# EasyEDA Pro project ProPrj_Practice 4 layer_2025-08-23.epro, schematic 4 Analog Outputs
Board Name: 4 Analog Outputs; Create Date: 2025-08-13; Page Name: P1; Project Name: Practice 4 layer; Schematic Name: 4 Analog Outputs; Update Date: 2025-08-21; Company: EasyEDA.com; Page Size: A4; Version: V1.0
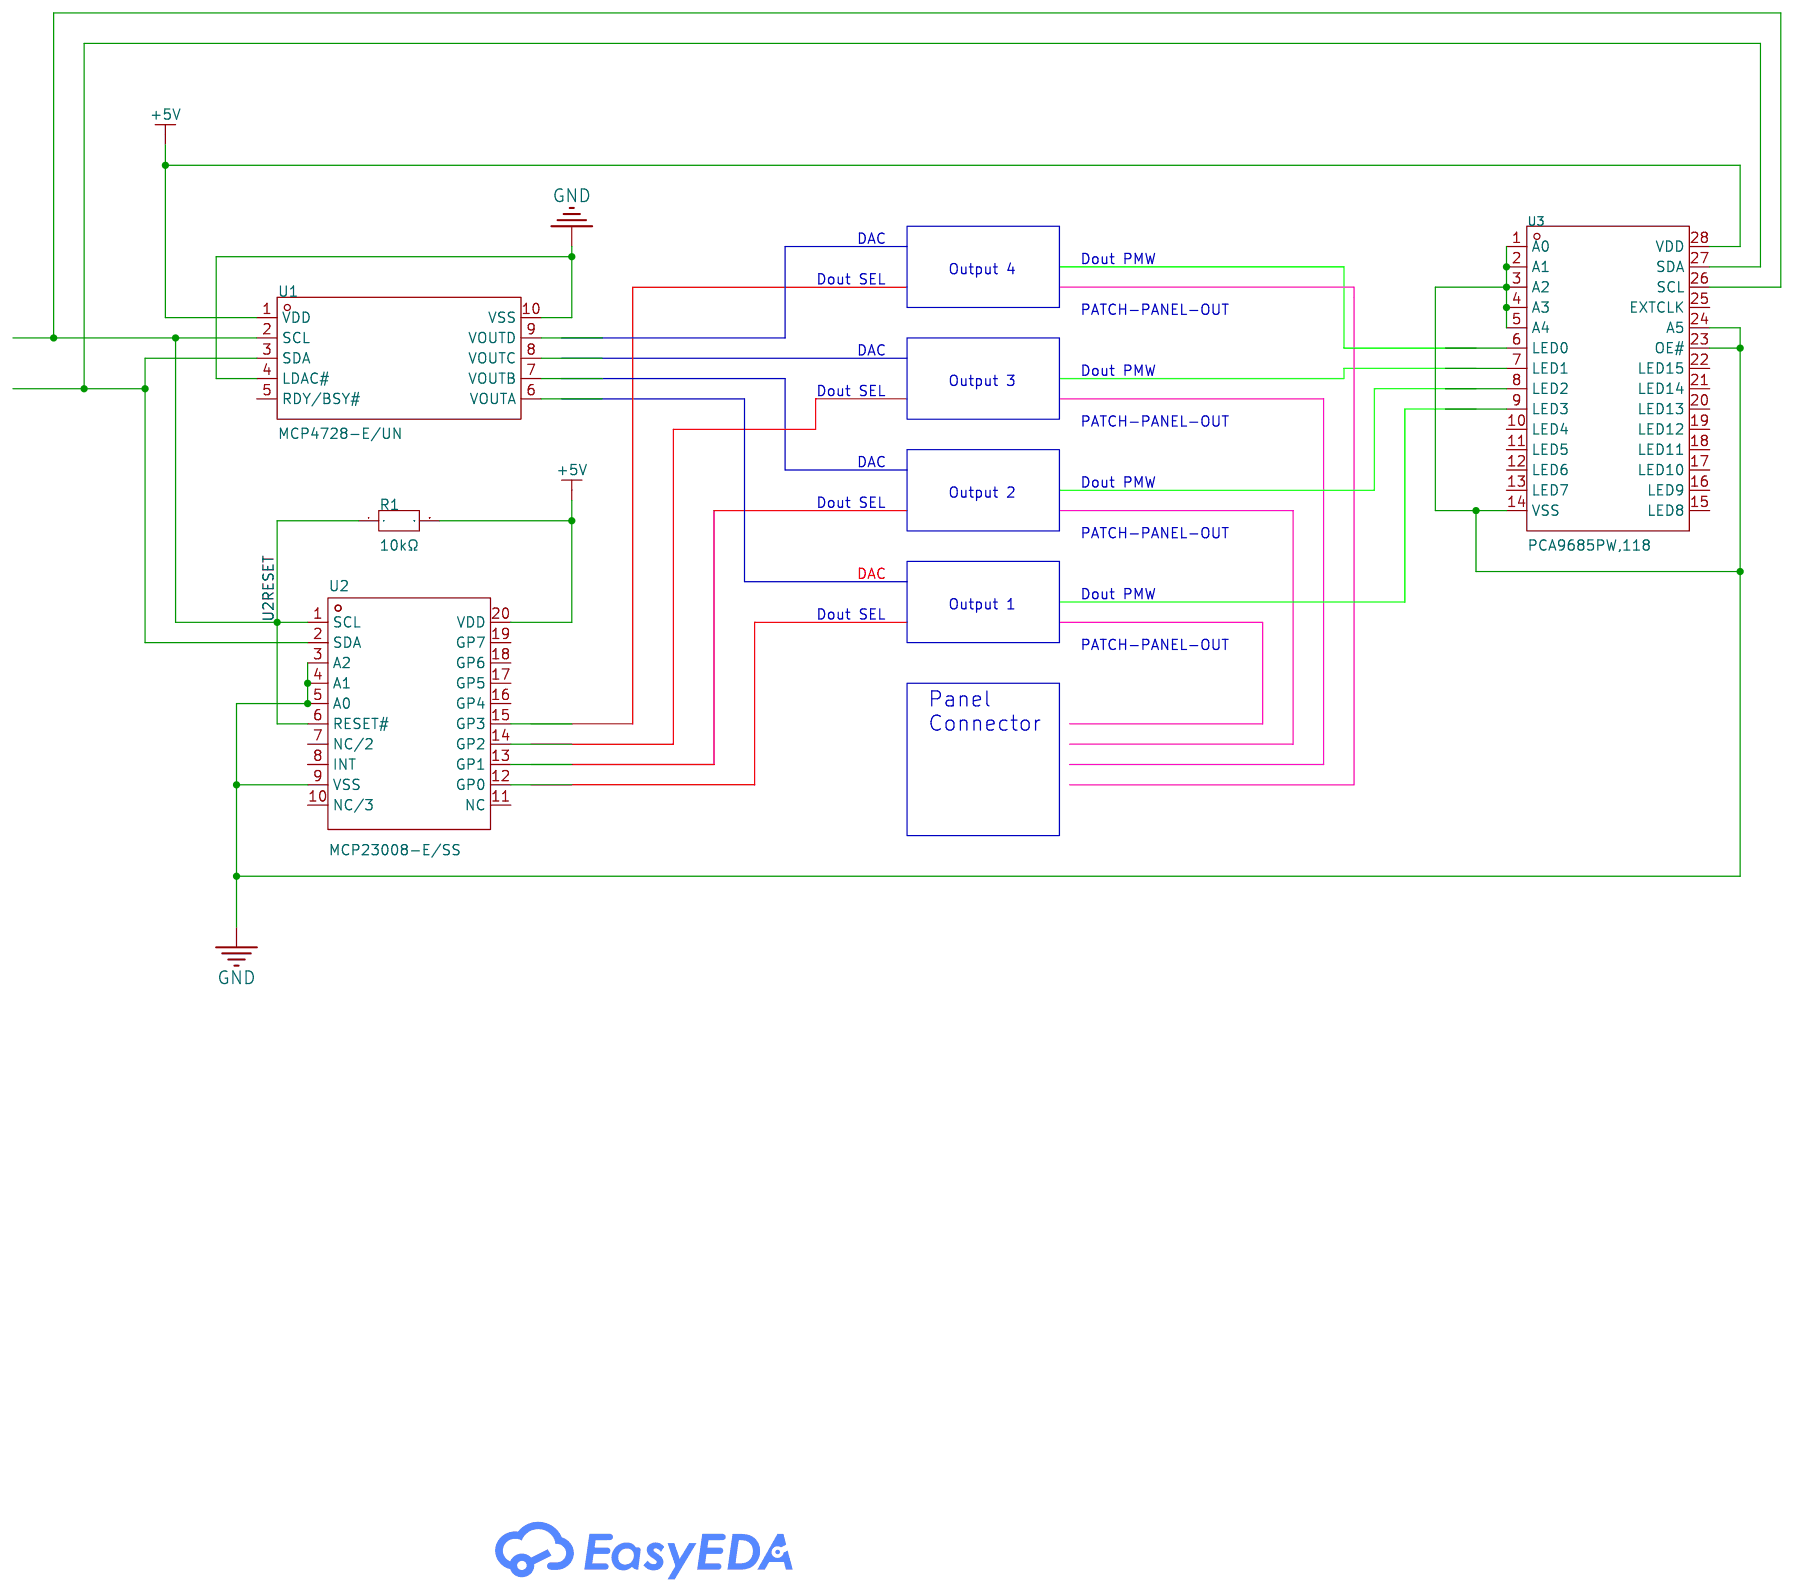
[diagram p6: schematic sheet]

## Parts
R1  10kΩ  [R0603]
U1  MCP4728-E/UN  [MSOP-10_L3.0-W3.0-P0.50-LS5.0-TL]
U2  MCP23008-E/SS  [SSOP-20_L7.2-W5.3-P0.65-LS7.8-BL]
U3  PCA9685PW,118  [TSSOP-28_L9.7-W4.4-P0.65-LS6.4-TL]

## Library data of the parts
R1 = FRC0603J103 TS: Type:Thick Film Resistors Resistance:10kΩ Tolerance:±5% Tolerance:±5% Power(Watts):0.1W Voltage-Supply(Max):75V Temperature Coefficient:±100ppm/℃ Temperature Coefficient:±100ppm/℃ Operating Temperature:-55℃~+155℃ Operating Temperature:-55℃~+155℃; LCSC Part Name: 10kΩ ±5% 100mW 厚膜电阻; Supplier Part: C2930027; Manufacturer: FOJAN(富捷); Supplier Footprint: 0603; JLCPCB Part Class: Extended Part; Datasheet: https://atta.szlcsc.com/upload/public/pdf/source/20211221/925EC7D7225764EE0046F22065062C87.pdf; Supplier: LCSC; Type: Thick Film Resistors; Tolerance: ±5%; Power(Watts): 0.1W; Voltage-Supply(Max): 75V; Temperature Coefficient: ±100ppm/℃; Operating Temperature: -55℃~+155℃
U1 = MCP4728-E/UN: Resolution(Bits):12Bit Number of Channels:4 Interface:I2C Voltage - Supply:2.7V~5.5V Voltage - Supply:2.7V~5.5V Settling Time:6us Output Type:- INL/DNL(LSB):2LSB INL/DNL(LSB):2LSB Operating Temperature:-40℃~+125℃ Operating Temperature:-40℃~+125℃; LCSC Part Name: F; Supplier Part: C108207; Manufacturer: MICROCHIP(美国微芯); Supplier Footprint: MSOP-10; JLCPCB Part Class: Extended Part; Datasheet: https://atta.szlcsc.com/upload/public/pdf/source/20180207/C108207_15179947749381359004.pdf; Supplier: LCSC; Resolution(Bits): 12Bit; Number of Channels: 4; Interface: I2C; Voltage - Supply: 2.7V~5.5V; Settling Time: 6us; INL/DNL(LSB): 2LSB; Operating Temperature: -40℃~+125℃
U2 = MCP23008-E/SS: Interface:I2C Number of I/O:8 Interrupt Output:With Interrupt Output Output Type: Supply Voltage:- Supply Voltage:- Output Source current:- Output Sink Current:- Clock Frequency:1.7MHz Operating Temperature:- Operating Temperature:-; LCSC Part Name: 8位I/O扩展器带串行接口; Supplier Part: C148011; Manufacturer: MICROCHIP(美国微芯); Supplier Footprint: SSOP-20-208mil; JLCPCB Part Class: Extended Part; Datasheet: https://atta.szlcsc.com/upload/public/pdf/source/20171228/C152205_15144475388971215001.pdf; Supplier: LCSC; Interface: I2C; Number of I/O: 8; Interrupt Output: With Interrupt Output; Clock Frequency: 1.7MHz
U3 = PCA9685PW,118: Type:- Voltage - Input(DC):2.3V~5.5V Voltage - Input(DC):2.3V~5.5V Frequency - Switching:100kHz~1MHz Frequency - Switching:100kHz~1MHz Number of Channels:16 Output Voltage:- Output Voltage:- Output Current:25mA Dimming:PWM Operating temperature:-40℃~+85℃; Supplier Part: C2678753; Manufacturer: NXP(恩智浦); Supplier Footprint: TSSOP-28; JLCPCB Part Class: Extended Part; Datasheet: https://www.nxp.com.cn/docs/en/data-sheet/PCA9685.pdf; Supplier: LCSC; Voltage - Input(DC): 2.3V~5.5V; Frequency - Switching: 100kHz~1MHz; Number of Channels: 16; Output Current: 25mA; Dimming: PWM; Operating temperature: -40℃~+85℃

## Nets
+5V: R1.2 U1.1(VDD) U2.20(VDD) U3.28(VDD)
GND: U1.4(LDAC#) U1.10(VSS) U2.3(A2) U2.4(A1) U2.5(A0) U2.9(VSS) U3.1(A0) U3.2(A1) U3.3(A2) U3.4(A3) U3.5(A4) U3.14(VSS) U3.23(OE#) U3.24(A5)
CH1_DAC-OUT: U1.9(VOUTD)
CH1_DOUT-PWM: U3.6(LED0)
CH1_DOUT-SEL: U2.15(GP3)
CH2_DAC-OUT: U1.8(VOUTC)
CH2_DOUT-PWM: U3.7(LED1)
CH2_DOUT-SEL: U2.14(GP2)
CH3_DAC-OUT: U1.7(VOUTB)
CH3_DOUT-PWM: U3.8(LED2)
CH3_DOUT-SEL: U2.13(GP1)
CH4_DAC-OUT: U1.6(VOUTA)
CH4_DOUT-PWM: U3.9(LED3)
CH4_DOUT-SEL: U2.12(GP0)
U2RESET: R1.1 U2.6(RESET#)
Net-(U1-2): U1.2(SCL) U2.1(SCL) U3.26(SCL)
Net-(U1-3): U1.3(SDA) U2.2(SDA) U3.27(SDA)

Not connected (* = marked no-connect by the designer): U1 5(RDY/BSY#); U2 7(NC/2) 8(INT) 10(NC/3) 11(NC) 16(GP4) 17(GP5) 18(GP6) 19(GP7); U3 10(LED4) 11(LED5) 12(LED6) 13(LED7) 15(LED8) 16(LED9) 17(LED10) 18(LED11) 19(LED12) 20(LED13) 21(LED14) 22(LED15) 25(EXTCLK)

## Notes on the sheet
- DAC
- Dout SEL
- Output 4
- Dout PMW
- PATCH-PANEL-OUT
- DAC
- Dout PMW
- Dout SEL
- Output 3
- PATCH-PANEL-OUT
- DAC
- Output 2
- Dout PMW
- Dout SEL
- PATCH-PANEL-OUT
- DAC
- Dout SEL
- Output 1
- Dout PMW
- PATCH-PANEL-OUT
- Panel
  Connector
